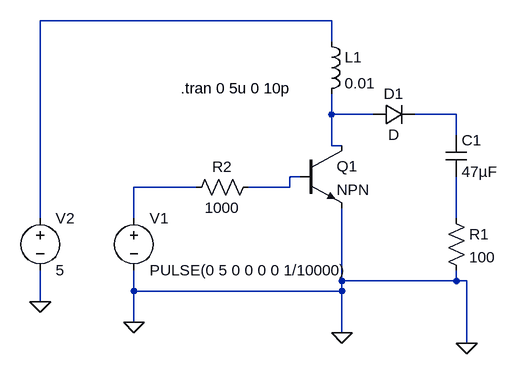
[diagram p0: schematic Draft5.asc]
Draft5.asc, the LTspice schematic file:
Version 4
SHEET 1 880 680
WIRE 224 80 -224 80
WIRE 224 112 224 80
WIRE 224 224 224 192
WIRE 288 224 224 224
WIRE 416 224 352 224
WIRE 416 256 416 224
WIRE 224 272 224 224
WIRE 240 272 224 272
WIRE 176 320 160 320
WIRE 16 336 -80 336
WIRE 160 336 160 320
WIRE 160 336 96 336
WIRE -224 384 -224 80
WIRE -80 384 -80 336
WIRE 416 384 416 320
WIRE 240 480 240 368
WIRE 416 480 416 464
WIRE 416 480 240 480
WIRE 432 480 416 480
WIRE -80 496 -80 464
WIRE 240 496 240 480
WIRE 240 496 -80 496
WIRE -224 512 -224 464
WIRE -80 544 -80 496
WIRE 240 560 240 496
WIRE 432 576 432 480
FLAG -224 512 0
FLAG -80 544 0
FLAG 240 560 0
FLAG 432 576 0
SYMBOL ind 208 96 R0
SYMATTR InstName L1
SYMATTR Value 0.01
SYMBOL npn 176 272 R0
SYMATTR InstName Q1
SYMBOL cap 400 256 R0
SYMATTR InstName C1
SYMATTR Value 47µF
SYMBOL res 400 368 R0
SYMATTR InstName R1
SYMATTR Value 100
SYMBOL res 112 320 R90
WINDOW 0 0 56 VBottom 2
WINDOW 3 32 56 VTop 2
SYMATTR InstName R2
SYMATTR Value 1000
SYMBOL voltage -80 368 R0
SYMATTR InstName V1
SYMATTR Value PULSE(0 5 0 0 0 0 1/10000)
SYMBOL voltage -224 368 R0
SYMATTR InstName V2
SYMATTR Value 5
SYMBOL diode 288 240 R270
WINDOW 0 32 32 VTop 2
WINDOW 3 0 32 VBottom 2
SYMATTR InstName D1
TEXT -8 184 Left 2 !.tran 0 5u 0 10p

The netlist it stands for:
* Draft5.asc
L1 N001 N002 0.01
Q1 N002 N004 0 0 NPN
C1 N003 N006 47µF
R1 N006 0 100
R2 N004 N005 1000
V1 N005 0 PULSE(0 5 0 0 0 0 1/10000)
V2 N001 0 5
D1 N002 N003 D
.model D D
.lib standard.dio
.model NPN NPN
.model PNP PNP
.lib standard.bjt
.tran 0 5u 0 10p
.backanno
.end